# EAGLE design Strobe (EAGLE 6.1)
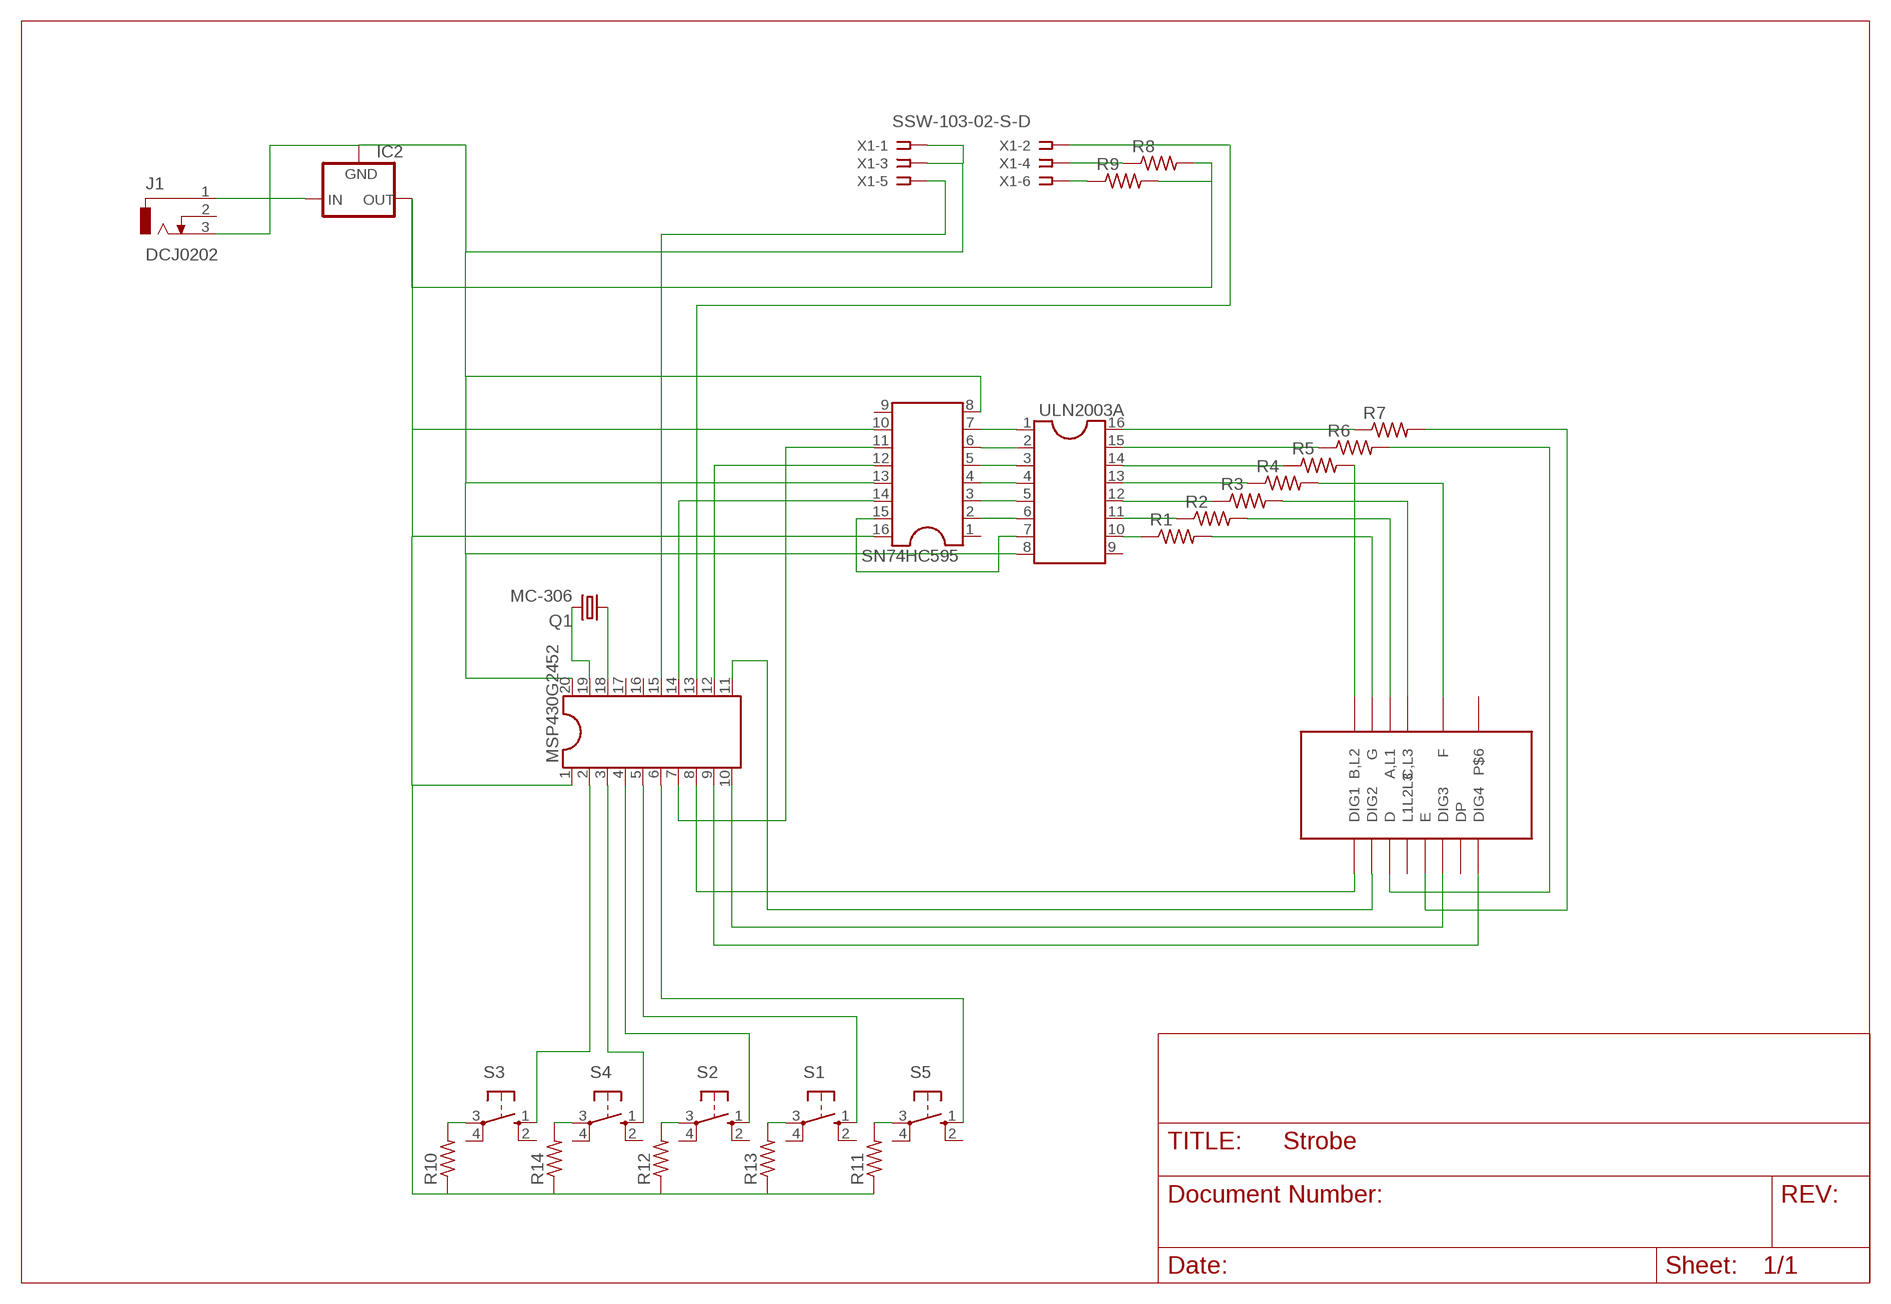
[diagram p0: schematic, sheet 1]

## Parts
IC2  78XXS  [78XXS]
J1  DCJ0202  [DCJ0202]
LTC-4627JS  SEG4X7  [HDSP-R]
MSP430G2452  DIL20S  [SOCKET-20]
Q1  MC-306  [MC-306]
R1  R-US_0207/7  [0207/7]
R2  R-US_0207/7  [0207/7]
R3  R-US_0207/7  [0207/7]
R4  R-US_0207/7  [0207/7]
R5  R-US_0207/7  [0207/7]
R6  R-US_0207/7  [0207/7]
R7  R-US_0207/7  [0207/7]
R8  R-US_0207/7  [0207/7]
R9  R-US_0207/7  [0207/7]
R10  R-US_0207/7  [0207/7]
R11  R-US_0207/7  [0207/7]
R12  R-US_0207/7  [0207/7]
R13  R-US_0207/7  [0207/7]
R14  R-US_0207/7  [0207/7]
S1  10-XX  [B3F-10XX]
S2  10-XX  [B3F-10XX]
S3  10-XX  [B3F-10XX]
S4  10-XX  [B3F-10XX]
S5  10-XX  [B3F-10XX]
SN74HC595  DIL16  [DIL16]
ULN2003A  DIL16  [DIL16]
X1  SSW-103-02-S-D  [SSW-103-02-S-D]

## Nets
N$1: MSP430G2452.19 Q1.4
N$2: MSP430G2452.14 SN74HC595.14
N$3: MSP430G2452.7 SN74HC595.11
N$4: LTC-4627JS.DIG4 MSP430G2452.9
N$5: MSP430G2452.2 S3.1(S)
N$6: LTC-4627JS.DIG1 MSP430G2452.8
N$7: LTC-4627JS.DIG2 MSP430G2452.11
N$8: IC2.IN J1.1
N$10: MSP430G2452.12 SN74HC595.12
N$11: SN74HC595.6 ULN2003A.2
N$12: MSP430G2452.6 S5.1(S)
N$13: MSP430G2452.5 S1.1(S)
N$14: MSP430G2452.4 S2.1(S)
N$15: MSP430G2452.3 S4.1(S)
N$16: R7.1 ULN2003A.16
N$17: R6.1 ULN2003A.15
N$18: R5.1 ULN2003A.14
N$19: R4.1 ULN2003A.13
N$20: R3.1 ULN2003A.12
N$21: R2.1 ULN2003A.11
N$22: R1.1 ULN2003A.10
N$23: SN74HC595.7 ULN2003A.1
N$25: SN74HC595.5 ULN2003A.3
N$26: SN74HC595.4 ULN2003A.4
N$27: SN74HC595.3 ULN2003A.5
N$28: SN74HC595.2 ULN2003A.6
N$29: SN74HC595.15 ULN2003A.7
N$30: LTC-4627JS.G R1.2
N$31: LTC-4627JS.A,L1 R2.2
N$32: LTC-4627JS.C,L3 R3.2
N$33: LTC-4627JS.F R4.2
N$34: LTC-4627JS.B,L2 R5.2
N$35: LTC-4627JS.D R6.2
N$36: LTC-4627JS.E R7.2
N$37: MSP430G2452.15 X1.5
N$38: R12.2 S2.3(P)
N$39: R14.2 S4.3(P)
N$40: R13.2 S1.3(P)
N$41: R11.2 S5.3(P)
N$42: R10.2 S3.3(P)
N$43: IC2.OUT MSP430G2452.1 R8.2 R9.2 R10.1 R11.1 R12.1 R13.1 R14.1 SN74HC595.10 SN74HC595.16
N$44: IC2.GND J1.3 MSP430G2452.20 SN74HC595.8 SN74HC595.13 ULN2003A.8 X1.1 X1.3
N$45: MSP430G2452.18 Q1.1
N$46: R9.1 X1.6
N$47: R8.1 X1.4
N$48: MSP430G2452.13 X1.2
N$49: LTC-4627JS.DIG3 MSP430G2452.10
Unconnected: J1.2 LTC-4627JS.DP LTC-4627JS.L1,L2,L3(L1L2L3) LTC-4627JS.NULL MSP430G2452.16 MSP430G2452.17 S1.2(S1) S1.4(P1) S2.2(S1) S2.4(P1) S3.2(S1) S3.4(P1) S4.2(S1) S4.4(P1) S5.2(S1) S5.4(P1) SN74HC595.1 SN74HC595.9 ULN2003A.9

## Library data of the parts
IC2 = v-reg:78XXS: VOLTAGE REGULATOR
J1 = con-jack:DCJ0202: DC POWER JACK Source: DCJ0202.pdf; OC_FARNELL: unknown; OC_NEWARK: unknown
LTC-4627JS = 7SEG:SEG4X7
MSP430G2452 = ic-package:DIL20: Dual In Line / Socket
Q1 = crystal:MC-306: kHz RANGE CRYSTAL UNIT SMD Source: MC-306_405_406_E07X.PDF Homepage <http://www.epsontoyocom.co.jp>; MPN: MC-306 60.0KHZ 100PPM ,12.5PF; OC_FARNELL: 1278040; OC_NEWARK: 31M5576
R1-R14 = resistor:R-US_: RESISTOR, American symbol
S1-S5 = switch-omron:10-XX: OMRON SWITCH; MPN: B3F-1000; OC_FARNELL: 176432; OC_NEWARK: 36M3542
SN74HC595 ULN2003A = ic-package:DIL16: Dual In Line / Socket
X1 = con-samtec:SSW-103-02-S-D: THROUGH-HOLE .025" SQ POST SOCKET Source: Samtec SSW.pdf; MPN: SSW-103-02-S-D; OC_FARNELL: unknown; OC_NEWARK: 11P9365

## Board
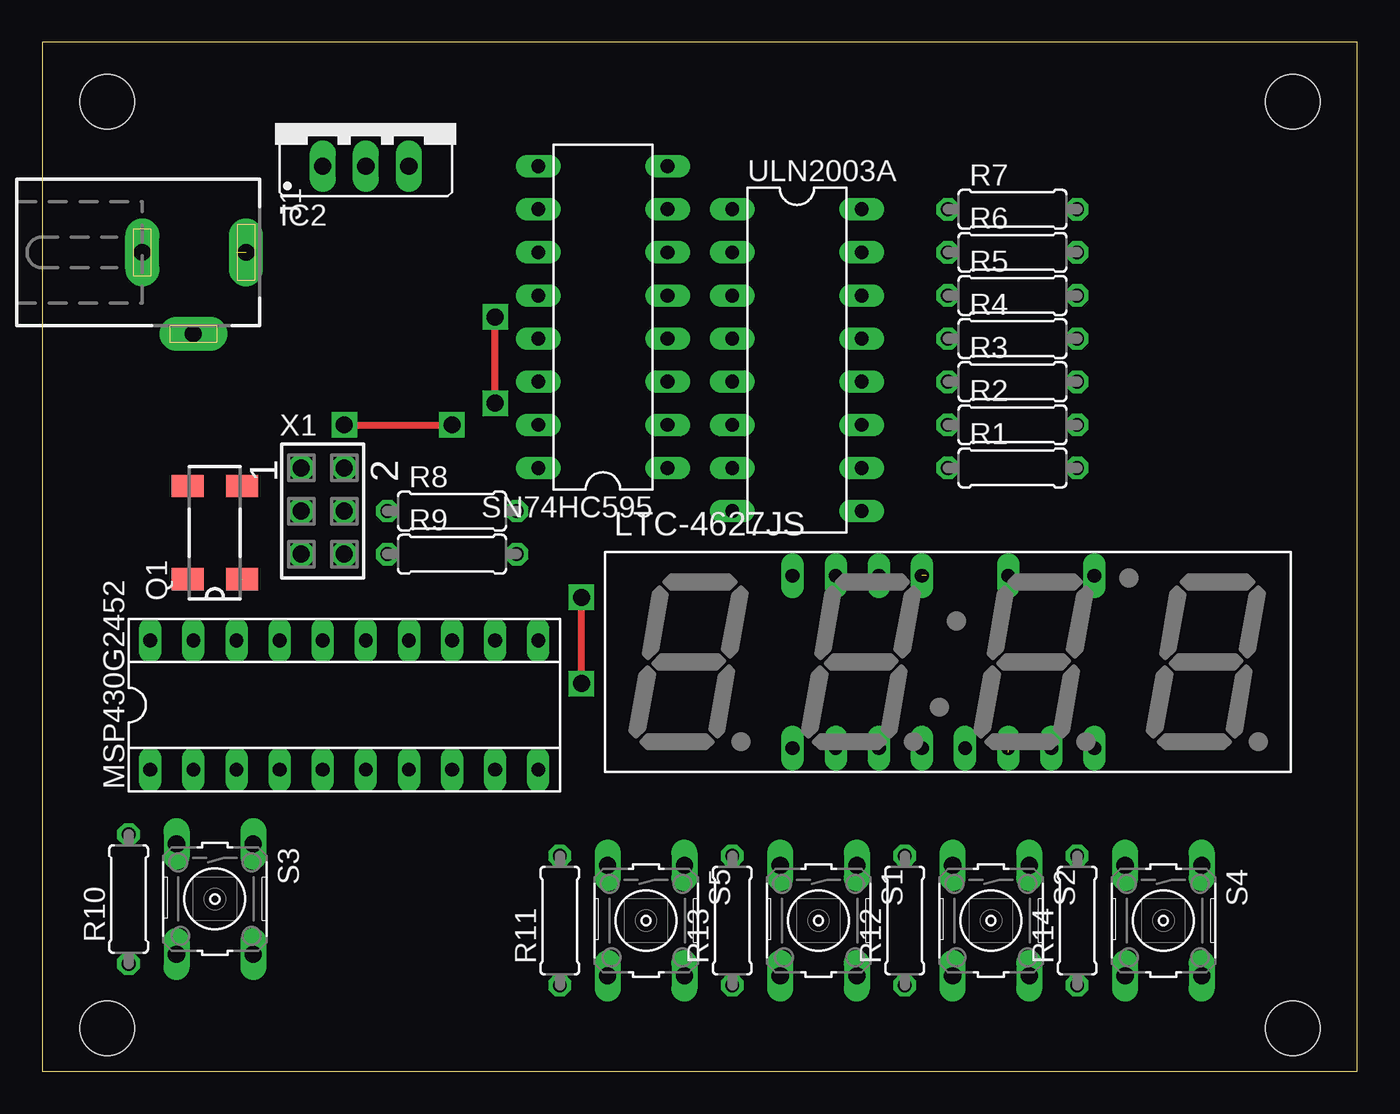
[diagram p1: board, top side]
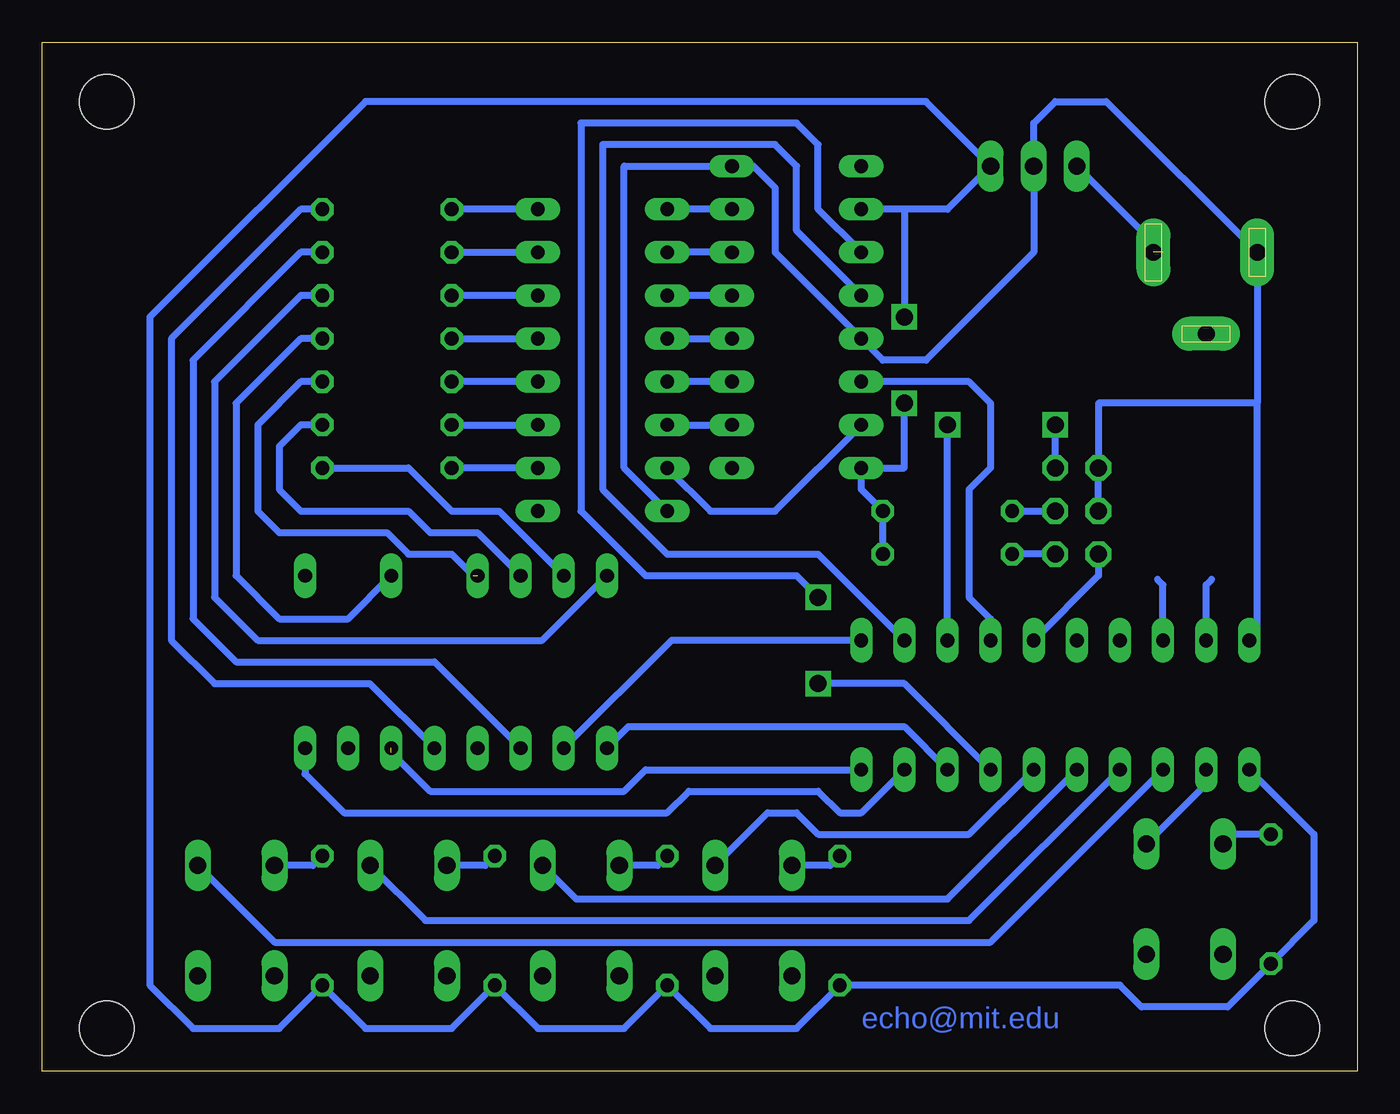
[diagram p2: board, bottom side, seen from below]

Size 77.45 x 60.63 mm. Coordinates in mm from the lower left corner, seen from the top.
Outline: 0,0 77.45,0 77.45,60.63 0,60.63 0,0
Copper layers (1*16): Top 0.035mm / dielectric 1.5mm / Bottom 0.035mm
Design rules: minimum track width 10mil, minimum drill 24mil, track to track 8mil, track to pad 8mil, pad to pad 8mil, via to via 8mil, smd to smd 8mil, copper to edge 40mil, drill to drill 8mil, minimum pad ring 10mil, minimum via ring 8mil, stop-mask expansion 4mil, vias tented up to drill 0mil, thermal gap 10mil
Holes 3.2 mm at 3.81,57.15 73.66,57.15 73.66,2.54 3.81,2.54

### Footprints (pad centres in the part's own frame; a part is rotated, then mirrored left to right if it is on the bottom)
78XXS = drill 1.016 long: GND 0,-2.54; IN -2.54,-2.54; OUT 2.54,-2.54
DCJ0202 = drill 1 pad 2 long: 1 0,3.1; 2 4.8,0; 3 0,-3
HDSP-R = drill 0.813 long: A,L1 -4.064,5.08; B,L2 -9.144,5.08; C,L3 -1.524,5.08; D -4.064,-5.08; DIG1 -9.144,-5.08; DIG2 -6.604,-5.08; DIG3 3.556,-5.08; DIG4 8.636,-5.08; DP 6.096,-5.08; E 1.016,-5.08; F 3.556,5.08; G -6.604,5.08; L1,L2,L3 -1.524,-5.08; NULL 8.636,5.08
SOCKET-20 = drill 0.813 long: 1 -11.43,-3.81; 2 -8.89,-3.81; 3 -6.35,-3.81; 4 -3.81,-3.81; 5 -1.27,-3.81; 6 1.27,-3.81; 7 3.81,-3.81; 8 6.35,-3.81; 9 8.89,-3.81; 10 11.43,-3.81; 11 11.43,3.81; 12 8.89,3.81; 13 6.35,3.81; 14 3.81,3.81; 15 1.27,3.81; 16 -1.27,3.81; 17 -3.81,3.81; 18 -6.35,3.81; 19 -8.89,3.81; 20 -11.43,3.81
MC-306 = smd 1.3 x 1.9: 1 -2.75,-1.6; 2 2.75,-1.6; 3 2.75,1.6; 4 -2.75,1.6
0207/7 = drill 0.813 octagon: 1 -3.81,0; 2 3.81,0
B3F-10XX = drill 1.016 long: 1 -3.251,2.261; 2 3.251,2.261; 3 -3.251,-2.261; 4 3.251,-2.261
DIL16 = drill 0.813 long: 1 -8.89,-3.81; 2 -6.35,-3.81; 3 -3.81,-3.81; 4 -1.27,-3.81; 5 1.27,-3.81; 6 3.81,-3.81; 7 6.35,-3.81; 8 8.89,-3.81; 9 8.89,3.81; 10 6.35,3.81; 11 3.81,3.81; 12 1.27,3.81; 13 -1.27,3.81; 14 -3.81,3.81; 15 -6.35,3.81; 16 -8.89,3.81
SSW-103-02-S-D = drill 1 pad 1.5 octagon: 1 -2.54,-1.27; 2 -2.54,1.27; 3 0,-1.27; 4 0,1.27; 5 2.54,-1.27; 6 2.54,1.27

### Placement (x,y rotation side)
IC2  19.05,55.88 0 top
J1  8.89,48.26 270 top
LTC-4627JS  53.34,24.13 0 top
MSP430G2452  17.78,21.59 0 top
Q1  10.16,31.75 90 top
R1  57.15,35.56 0 top
R2  57.15,38.1 0 top
R3  57.15,40.64 0 top
R4  57.15,43.18 0 top
R5  57.15,45.72 0 top
R6  57.15,48.26 0 top
R7  57.15,50.8 0 top
R8  24.13,33.02 0 top
R9  24.13,30.48 0 top
R10  5.08,10.16 90 top
R11  30.48,8.89 90 top
R12  50.8,8.89 90 top
R13  40.64,8.89 90 top
R14  60.96,8.89 90 top
S1  45.72,8.89 270 top
S2  55.88,8.89 270 top
S3  10.16,10.16 270 top
S4  66.04,8.89 270 top
S5  35.56,8.89 270 top
SN74HC595  33.02,44.45 90 top
ULN2003A  44.45,41.91 270 top
X1  16.51,33.02 270 top

### Tracks (layer width: path | path; a pad name or v marks a point on that pad's centre or on a via)
N$1  (1 unrouted)
  Bottom 0.406: MSP430G2452.19 8.89,28.67 Q1.4
N$2
  Bottom 0.406: MSP430G2452.14 21.59,26.67 22.86,27.94 22.86,34.29 21.59,35.56 21.59,39.37 22.86,40.64 SN74HC595.14
N$3  (via drill 1)
  Top 0.406: v31.75,22.86 v31.75,27.94
  Bottom 0.406: SN74HC595.11 31.75,50.8 31.75,54.61 33.02,55.88 45.72,55.88 45.72,33.02 41.91,29.21 33.02,29.21 v31.75,27.94 | MSP430G2452.7 26.67,22.86 v31.75,22.86
N$4
  Bottom 0.406: LTC-4627JS.DIG4 61.98,17.53 59.69,15.24 40.64,15.24 39.37,16.51 31.75,16.51 30.48,15.24 29.21,15.24 MSP430G2452.9
N$5
  Bottom 0.406: S3.1 8.89,16.94 MSP430G2452.2
N$6
  Bottom 0.406: LTC-4627JS.DIG1 42.93,20.32 26.67,20.32 MSP430G2452.8
N$7
  Bottom 0.406: MSP430G2452.11 40.39,25.4 LTC-4627JS.DIG2
N$8  (1 unrouted)
  Bottom 0.406: IC2.IN 11.43,48.26
N$10
  Bottom 0.406: SN74HC595.12 33.02,49.53 33.02,53.34 34.29,54.61 44.45,54.61 44.45,34.29 40.64,30.48 31.75,30.48 MSP430G2452.12
N$11
  Bottom 0.406: SN74HC595.6 ULN2003A.2
N$12
  Bottom 0.406: S5.1 34.72,15.24 33.02,15.24 31.75,13.97 22.86,13.97 MSP430G2452.6
N$13
  Bottom 0.406: S1.1 46,10.16 24.13,10.16 MSP430G2452.5
N$14
  Bottom 0.406: S2.1 54.89,8.89 22.86,8.89 MSP430G2452.4
N$15
  Bottom 0.406: S4.1 63.78,7.62 21.59,7.62 MSP430G2452.3
N$16
  Bottom 0.406: ULN2003A.16 R7.1
N$17
  Bottom 0.406: R6.1 ULN2003A.15
N$18
  Bottom 0.406: ULN2003A.14 R5.1
N$19
  Bottom 0.406: R4.1 ULN2003A.13
N$20
  Bottom 0.406: ULN2003A.12 R3.1
N$21
  Bottom 0.406: R2.1 ULN2003A.11
N$22
  Bottom 0.406: ULN2003A.10 R1.1
N$23
  Bottom 0.406: SN74HC595.7 ULN2003A.1
N$25
  Bottom 0.406: SN74HC595.5 ULN2003A.3
N$26
  Bottom 0.406: ULN2003A.4 SN74HC595.4
N$27
  Bottom 0.406: SN74HC595.3 ULN2003A.5
N$28
  Bottom 0.406: ULN2003A.6 SN74HC595.2
N$29
  Bottom 0.406: ULN2003A.7 38.1,33.02 34.29,33.02 SN74HC595.15
N$30
  Bottom 0.406: R1.2 55.88,35.56 53.34,33.02 50.55,33.02 LTC-4627JS.G
N$31
  Bottom 0.406: R2.2 62.23,38.1 63.5,36.83 63.5,34.29 62.23,33.02 55.88,33.02 54.61,31.75 51.82,31.75 LTC-4627JS.A,L1
N$32  (1 unrouted)
  Bottom 0.406: R3.2 62.23,40.64 64.77,38.1 64.77,33.02 63.5,31.75 57.15,31.75 55.88,30.48 53.34,30.48 52.07,29.21
N$33
  Bottom 0.406: R4.2 62.23,43.18 66.04,39.37 66.04,29.21 63.5,26.67 59.44,26.67 LTC-4627JS.F
N$34
  Bottom 0.406: R5.2 62.23,45.72 67.31,40.64 67.31,27.94 64.77,25.4 48.01,25.4 LTC-4627JS.B,L2
N$35
  Bottom 0.406: R6.2 62.23,48.26 68.58,41.91 68.58,26.67 66.04,24.13 54.36,24.13 LTC-4627JS.D
N$36
  Bottom 0.406: R7.2 62.23,50.8 69.85,43.18 69.85,25.4 67.31,22.86 58.17,22.86 LTC-4627JS.E
N$37
  Bottom 0.406: X1.5 15.24,29.21 MSP430G2452.15
N$38
  Bottom 0.406: R12.2 51.36,12.14 S2.3
N$39
  Bottom 0.406: R14.2 61.52,12.14 S4.3
N$40
  Bottom 0.406: R13.2 41.2,12.14 S1.3
N$41
  Bottom 0.406: R11.2 31.04,12.14 S5.3
N$42
  Bottom 0.406: R10.2 7.34,13.97 S3.3
N$43  (via drill 1)
  Top 0.406: v26.67,39.37 v26.67,44.45
  Bottom 0.406: MSP430G2452.1 2.54,13.97 2.54,8.89 R10.1 7.62,3.81 12.7,3.81 13.97,5.08 R11.1 33.02,2.54 38.1,2.54 R13.1 43.18,2.54 48.26,2.54 R12.1 53.34,2.54 58.42,2.54 R14.1 63.5,2.54 68.58,2.54 71.12,5.08 71.12,44.45 58.42,57.15 25.4,57.15 IC2.OUT 24.13,50.8 26.67,50.8 | 26.67,50.8 SN74HC595.10 | R9.2 R8.2 29.21,34.29 SN74HC595.16 26.67,35.56 v26.67,39.37 | 26.67,50.8 v26.67,44.45
N$44
  Bottom 0.406: ULN2003A.8 43.18,35.56 43.18,53.34 SN74HC595.8 35.56,53.34 34.29,52.07 34.29,48.26 SN74HC595.13 27.94,41.91 25.4,41.91 19.05,48.26 IC2.GND 19.05,55.88 17.78,57.15 14.78,57.15 J1.3 5.89,39.37 | X1.3 X1.1 15.24,39.37 5.89,39.37 | MSP430G2452.20 arc-90 5.89,25.86 5.89,39.37
N$45  (1 unrouted)
  Bottom 0.406: MSP430G2452.18 11.43,28.67 Q1.1
N$46
  Bottom 0.406: X1.6 R9.1
N$47
  Bottom 0.406: R8.1 X1.4
N$48  (via drill 1)
  Top 0.406: v17.78,38.1 v24.13,38.1
  Bottom 0.406: 17.78,36.83 X1.2 v17.78,38.1 | MSP430G2452.13 v24.13,38.1
N$49  (1 unrouted)
  Bottom 0.406: 56.9,18.8 54.61,16.51 43.18,16.51 41.91,17.78 MSP430G2452.10

### Text on the board
Bottom: echo@mit.edu